# Altium schematic sheet Display_CPu.SchDoc: Display Card
size Tabloid; Date: 03/13/2023; Engineer: Terry D. Schevker; Address4: Display Card; Revision: 1.0; SheetNumber: 1; SheetTotal: 2
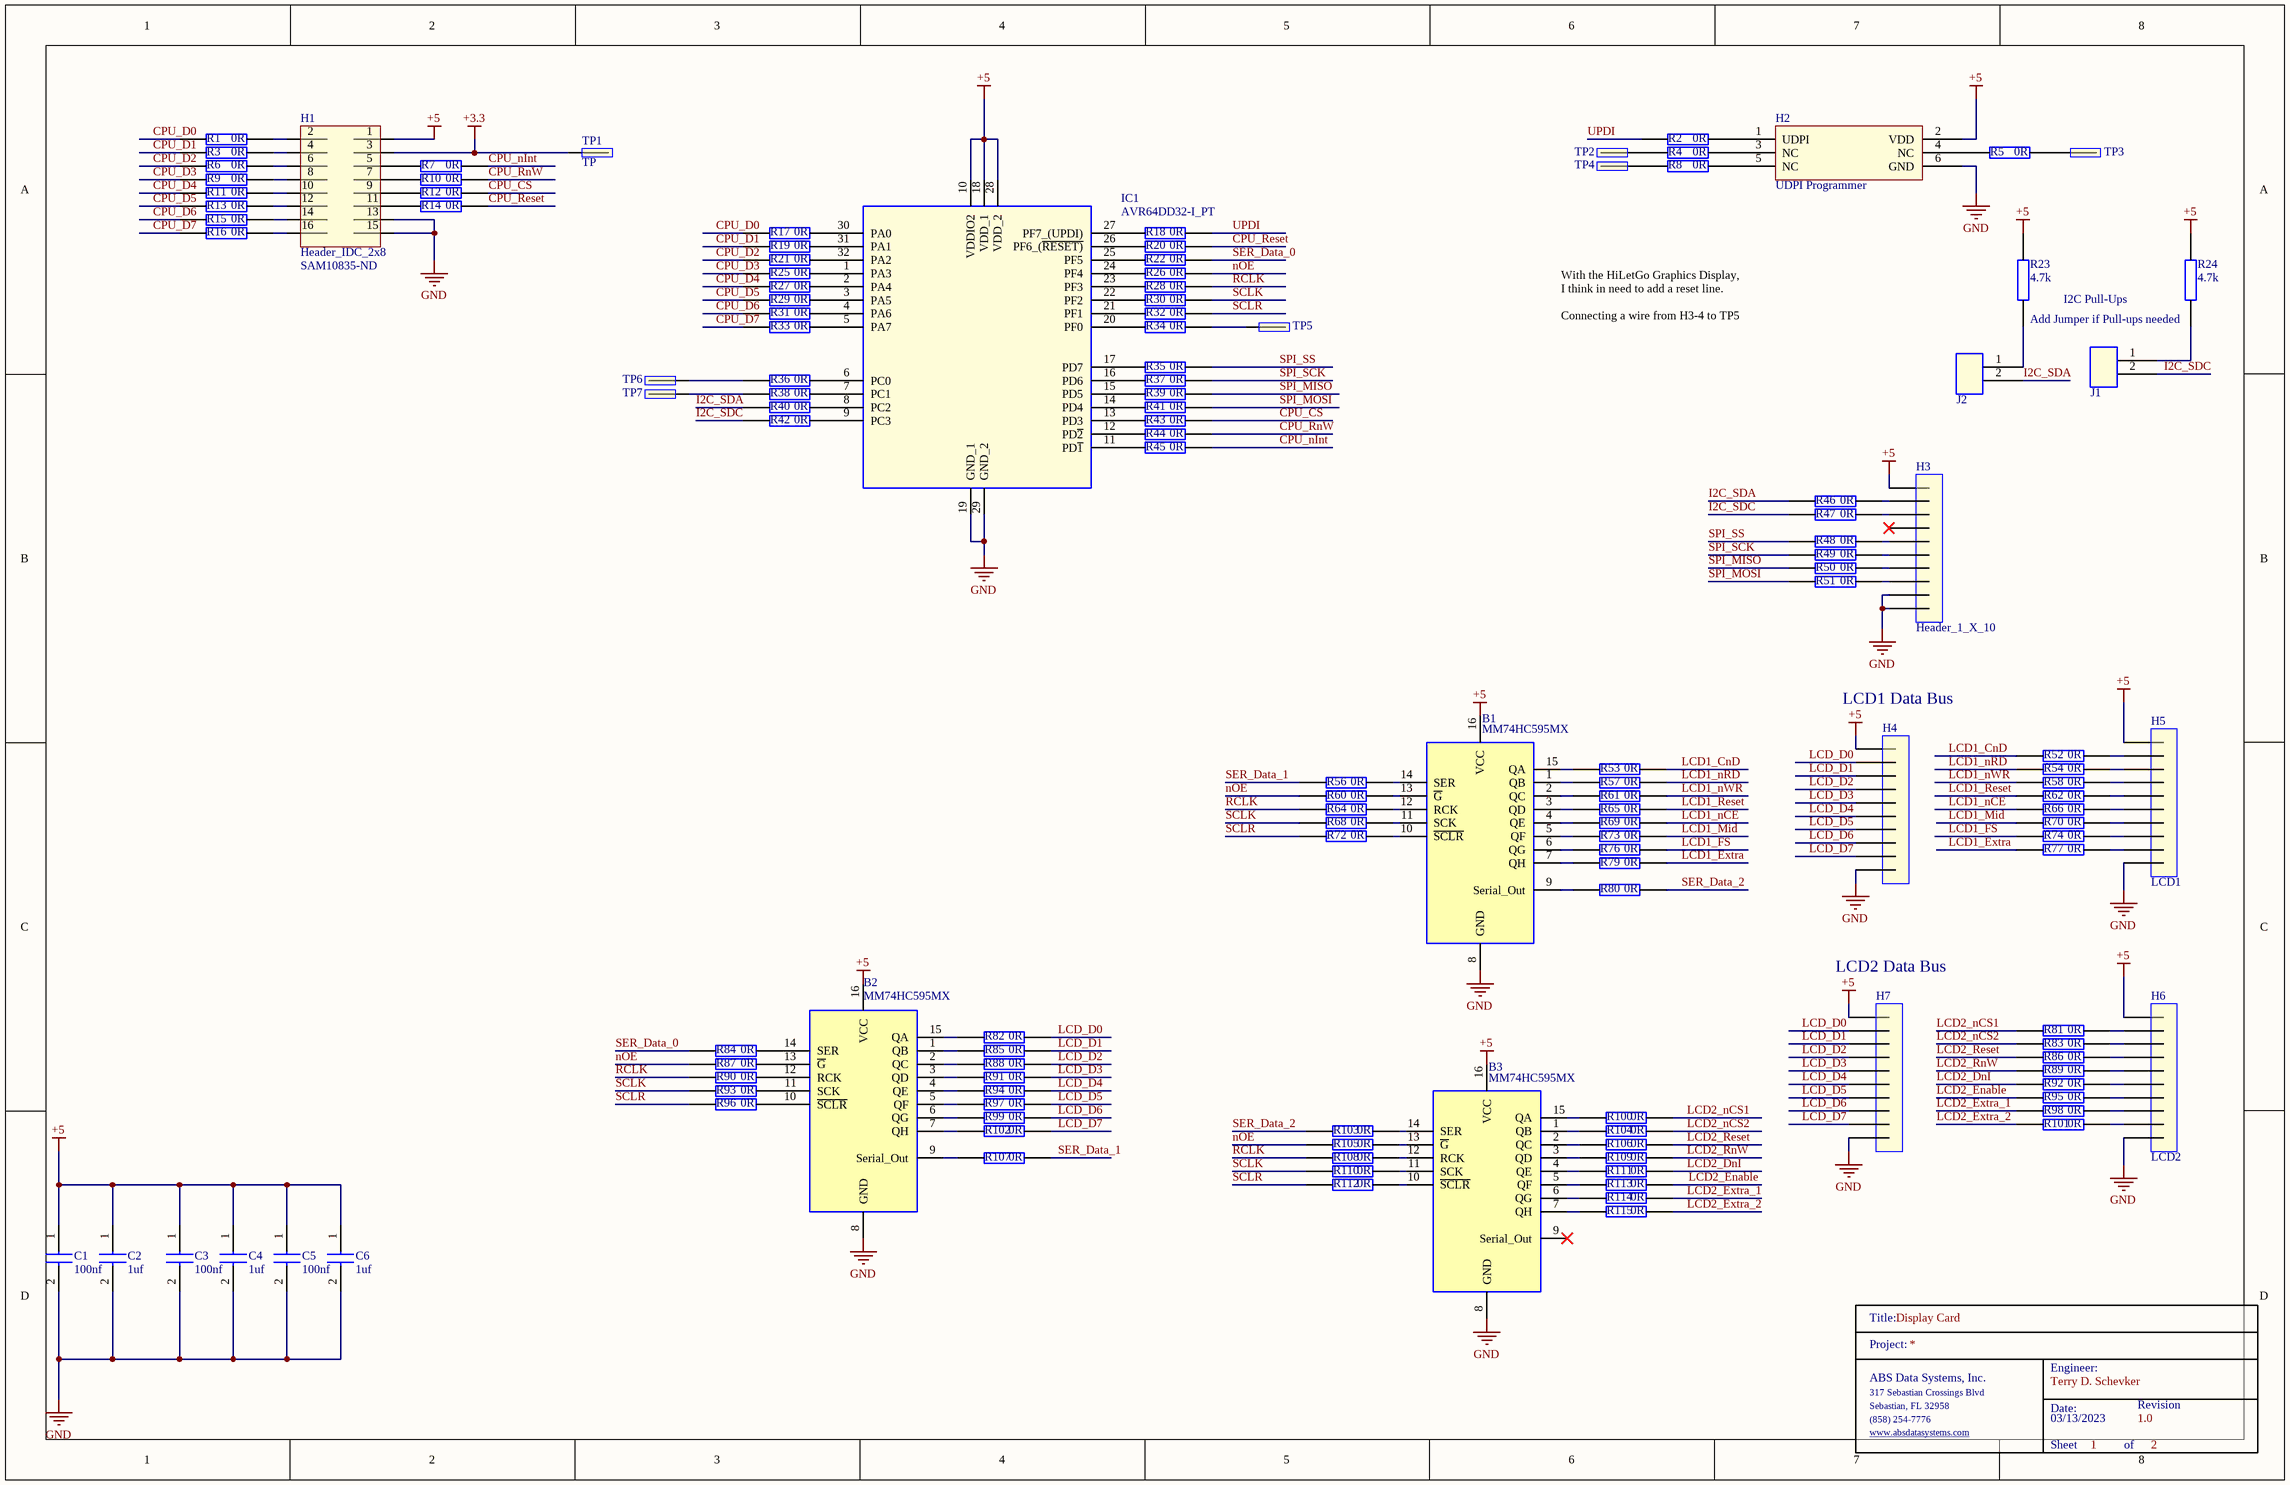
[diagram p0: Display_CPu.SchDoc]

## Parts
B1  MM74HC595MX  [SOIC127P600X175-16N]
B2  MM74HC595MX  [SOIC127P600X175-16N]
B3  MM74HC595MX  [SOIC127P600X175-16N]
C1  100nf  [0603]
C2  1uf  [0603]
C3  100nf  [0603]
C4  1uf  [0603]
C5  100nf  [0603]
C6  1uf  [0603]
H1  Header_IDC_2x8  Supplier Part Number 1: SAM10835-ND  [HEADER16]
H2  UDPI Programmer  [HDR2X3]
H3  Header_1_X_10  [TP_1X10]
H4  Header_1_X_10  [TP_1X10]  (value not drawn)
H5  LCD1  [TP_1X10]
H6  LCD2  [TP_1X10]
H7  Header_1_X_10  [TP_1X10]  (value not drawn)
IC1  AVR64DD32-I_PT  [QFP80P900X900X120-32N]
J1  Jumper  [Jumper]  (value not drawn)
J2  Jumper  [Jumper]  (value not drawn)
R1  0R  [0603]
R2  0R  [0603]
R3  0R  [0603]
R4  0R  [0603]
R5  0R  [0603]
R6  0R  [0603]
R7  0R  [0603]
R8  0R  [0603]
R9  0R  [0603]
R10  0R  [0603]
R11  0R  [0603]
R12  0R  [0603]
R13  0R  [0603]
R14  0R  [0603]
R15  0R  [0603]
R16  0R  [0603]
R17  0R  [0603]
R18  0R  [0603]
R19  0R  [0603]
R20  0R  [0603]
R21  0R  [0603]
R22  0R  [0603]
R23  4.7k  [0603]
R24  4.7k  [0603]
R25  0R  [0603]
R26  0R  [0603]
R27  0R  [0603]
R28  0R  [0603]
R29  0R  [0603]
R30  0R  [0603]
R31  0R  [0603]
R32  0R  [0603]
R33  0R  [0603]
R34  0R  [0603]
R35  0R  [0603]
R36  0R  [0603]
R37  0R  [0603]
R38  0R  [0603]
R39  0R  [0603]
R40  0R  [0603]
R41  0R  [0603]
R42  0R  [0603]
R43  0R  [0603]
R44  0R  [0603]
R45  0R  [0603]
R46  0R  [0603]
R47  0R  [0603]
R48  0R  [0603]
R49  0R  [0603]
R50  0R  [0603]
R51  0R  [0603]
R52  0R  [0603]
R53  0R  [0603]
R54  0R  [0603]
R56  0R  [0603]
R57  0R  [0603]
R58  0R  [0603]
R60  0R  [0603]
R61  0R  [0603]
R62  0R  [0603]
R64  0R  [0603]
R65  0R  [0603]
R66  0R  [0603]
R68  0R  [0603]
R69  0R  [0603]
R70  0R  [0603]
R72  0R  [0603]
R73  0R  [0603]
R74  0R  [0603]
R76  0R  [0603]
R77  0R  [0603]
R79  0R  [0603]
R80  0R  [0603]
R81  0R  [0603]
R82  0R  [0603]
R83  0R  [0603]
R84  0R  [0603]
R85  0R  [0603]
R86  0R  [0603]
R87  0R  [0603]
R88  0R  [0603]
R89  0R  [0603]
R90  0R  [0603]
R91  0R  [0603]
R92  0R  [0603]
R93  0R  [0603]
R94  0R  [0603]
R95  0R  [0603]
R96  0R  [0603]
R97  0R  [0603]
R98  0R  [0603]
R99  0R  [0603]
R100  0R  [0603]
R101  0R  [0603]
R102  0R  [0603]
R103  0R  [0603]
R104  0R  [0603]
R105  0R  [0603]
R106  0R  [0603]
R107  0R  [0603]
R108  0R  [0603]
R109  0R  [0603]
R110  0R  [0603]
R111  0R  [0603]
R112  0R  [0603]
R113  0R  [0603]
R114  0R  [0603]
R115  0R  [0603]
TitleBlock_1  TitleBlock  (value not drawn)  (graphical)
TP1  TP  [TP]
TP2  TP  [TP]  (value not drawn)
TP3  TP  [TP]  (value not drawn)
TP4  TP  [TP]  (value not drawn)
TP5  TP  [TP]  (value not drawn)
TP6  TP  [TP]  (value not drawn)
TP7  TP  [TP]  (value not drawn)

## Nets
+3.3: H1.3 TP1.1
+5: B1.16(VCC) B2.16(VCC) B3.16(VCC) C1.1 C2.1 C3.1 C4.1 C5.1 C6.1 H1.1 H2.2(VDD) H3.1 H4.1 H5.1 H6.1 H7.1 IC1.10(VDDIO2) IC1.18(VDD_1) IC1.28(VDD_2) R23.2 R24.2
GND: B1.8(GND) B2.8(GND) B3.8(GND) C1.2 C2.2 C3.2 C4.2 C5.2 C6.2 H1.13 H1.15 H2.6(GND) H3.9 H3.10 H4.10 H5.10 H6.10 H7.10 IC1.19(GND_1) IC1.29(GND_2)
CPU_CS: R12.2 R43.2
CPU_D0: R1.1 R17.1
CPU_D1: R3.1 R19.1
CPU_D2: R6.1 R21.1
CPU_D3: R9.1 R25.1
CPU_D4: R11.1 R27.1
CPU_D5: R13.1 R29.1
CPU_D6: R15.1 R31.1
CPU_D7: R16.1 R33.1
CPU_nInt: R7.2 R45.2
CPU_Reset: R14.2 R20.2
CPU_RnW: R10.2 R44.2
I2C_SDA: J2.2 R40.1 R46.1
I2C_SDC: J1.2 R42.1 R47.1
LCD1_CnD: R52.1 R53.2
LCD1_Extra: R77.1 R79.2
LCD1_FS: R74.1 R76.2
LCD1_Mid: R70.1 R73.2
LCD1_nCE: R66.1 R69.2
LCD1_nRD: R54.1 R57.2
LCD1_nWR: R58.1 R61.2
LCD1_Reset: R62.1 R65.2
LCD2_DnI: R92.1 R111.2
LCD2_Enable: R95.1 R113.2
LCD2_Extra_1: R98.1 R114.2
LCD2_Extra_2: R101.1 R115.2
LCD2_nCS1: R81.1 R100.2
LCD2_nCS2: R83.1 R104.2
LCD2_Reset: R86.1 R106.2
LCD2_RnW: R89.1 R109.2
LCD_D0: H4.2 H7.2 R82.2
LCD_D1: H4.3 H7.3 R85.2
LCD_D2: H4.4 H7.4 R88.2
LCD_D3: H4.5 H7.5 R91.2
LCD_D4: H4.6 H7.6 R94.2
LCD_D5: H4.7 H7.7 R97.2
LCD_D6: H4.8 H7.8 R99.2
LCD_D7: H4.9 H7.9 R102.2
nOE: R26.2 R60.1 R87.1 R105.1
RCLK: R28.2 R64.1 R90.1 R108.1
SCLK: R30.2 R68.1 R93.1 R110.1
SCLR: R32.2 R72.1 R96.1 R112.1
SER_Data_0: R22.2 R84.1
SER_Data_1: R56.1 R107.2
SER_Data_2: R80.2 R103.1
SPI_MISO: R39.2 R50.1
SPI_MOSI: R41.2 R51.1
SPI_SCK: R37.2 R49.1
SPI_SS: R35.2 R48.1
UPDI: R2.1 R18.2
NetB1_1: B1.1(QB) R57.1
NetB1_2: B1.2(QC) R61.1
NetB1_3: B1.3(QD) R65.1
NetB1_4: B1.4(QE) R69.1
NetB1_5: B1.5(QF) R73.1
NetB1_6: B1.6(QG) R76.1
NetB1_7: B1.7(QH) R79.1
NetB1_9: B1.9(Serial_Out) R80.1
NetB1_10: B1.10(~{SCLR}) R72.2
NetB1_11: B1.11(SCK) R68.2
NetB1_12: B1.12(RCK) R64.2
NetB1_13: B1.13(~{G}) R60.2
NetB1_14: B1.14(SER) R56.2
NetB1_15: B1.15(QA) R53.1
NetB2_1: B2.1(QB) R85.1
NetB2_2: B2.2(QC) R88.1
NetB2_3: B2.3(QD) R91.1
NetB2_4: B2.4(QE) R94.1
NetB2_5: B2.5(QF) R97.1
NetB2_6: B2.6(QG) R99.1
NetB2_7: B2.7(QH) R102.1
NetB2_9: B2.9(Serial_Out) R107.1
NetB2_10: B2.10(~{SCLR}) R96.2
NetB2_11: B2.11(SCK) R93.2
NetB2_12: B2.12(RCK) R90.2
NetB2_13: B2.13(~{G}) R87.2
NetB2_14: B2.14(SER) R84.2
NetB2_15: B2.15(QA) R82.1
NetB3_1: B3.1(QB) R104.1
NetB3_2: B3.2(QC) R106.1
NetB3_3: B3.3(QD) R109.1
NetB3_4: B3.4(QE) R111.1
NetB3_5: B3.5(QF) R113.1
NetB3_6: B3.6(QG) R114.1
NetB3_7: B3.7(QH) R115.1
NetB3_10: B3.10(~{SCLR}) R112.2
NetB3_11: B3.11(SCK) R110.2
NetB3_12: B3.12(RCK) R108.2
NetB3_13: B3.13(~{G}) R105.2
NetB3_14: B3.14(SER) R103.2
NetB3_15: B3.15(QA) R100.1
NetH1_2: H1.2 R1.2
NetH1_4: H1.4 R3.2
NetH1_5: H1.5 R7.1
NetH1_6: H1.6 R6.2
NetH1_7: H1.7 R10.1
NetH1_8: H1.8 R9.2
NetH1_9: H1.9 R12.1
NetH1_10: H1.10 R11.2
NetH1_11: H1.11 R14.1
NetH1_12: H1.12 R13.2
NetH1_14: H1.14 R15.2
NetH1_16: H1.16 R16.2
NetH2_1: H2.1(UDPI) R2.2
NetH2_3: H2.3(NC) R4.2
NetH2_4: H2.4(NC) R5.1
NetH2_5: H2.5(NC) R8.2
NetH3_2: H3.2 R46.2
NetH3_3: H3.3 R47.2
NetH3_5: H3.5 R48.2
NetH3_6: H3.6 R49.2
NetH3_7: H3.7 R50.2
NetH3_8: H3.8 R51.2
NetH5_2: H5.2 R52.2
NetH5_3: H5.3 R54.2
NetH5_4: H5.4 R58.2
NetH5_5: H5.5 R62.2
NetH5_6: H5.6 R66.2
NetH5_7: H5.7 R70.2
NetH5_8: H5.8 R74.2
NetH5_9: H5.9 R77.2
NetH6_2: H6.2 R81.2
NetH6_3: H6.3 R83.2
NetH6_4: H6.4 R86.2
NetH6_5: H6.5 R89.2
NetH6_6: H6.6 R92.2
NetH6_7: H6.7 R95.2
NetH6_8: H6.8 R98.2
NetH6_9: H6.9 R101.2
NetIC1_1: IC1.1(PA3) R25.2
NetIC1_2: IC1.2(PA4) R27.2
NetIC1_3: IC1.3(PA5) R29.2
NetIC1_4: IC1.4(PA6) R31.2
NetIC1_5: IC1.5(PA7) R33.2
NetIC1_6: IC1.6(PC0) R36.2
NetIC1_7: IC1.7(PC1) R38.2
NetIC1_8: IC1.8(PC2) R40.2
NetIC1_9: IC1.9(PC3) R42.2
NetIC1_11: IC1.11(PD~{1}) R45.1
NetIC1_12: IC1.12(PD~{2}) R44.1
NetIC1_13: IC1.13(PD3) R43.1
NetIC1_14: IC1.14(PD4) R41.1
NetIC1_15: IC1.15(PD5) R39.1
NetIC1_16: IC1.16(PD6) R37.1
NetIC1_17: IC1.17(PD7) R35.1
NetIC1_20: IC1.20(PF0) R34.1
NetIC1_21: IC1.21(PF1) R32.1
NetIC1_22: IC1.22(PF2) R30.1
NetIC1_23: IC1.23(PF3) R28.1
NetIC1_24: IC1.24(PF4) R26.1
NetIC1_25: IC1.25(PF5) R22.1
NetIC1_26: IC1.26(PF6_(~{RESET)}) R20.1
NetIC1_27: IC1.27(PF7_(UPDI)) R18.1
NetIC1_30: IC1.30(PA0) R17.2
NetIC1_31: IC1.31(PA1) R19.2
NetIC1_32: IC1.32(PA2) R21.2
NetJ1_1: J1.1 R24.1
NetJ2_1: J2.1 R23.1
NetR4_1: R4.1 TP2.1
NetR5_2: R5.2 TP3.1
NetR8_1: R8.1 TP4.1
NetR34_2: R34.2 TP5.1
NetR36_1: R36.1 TP6.1
NetR38_1: R38.1 TP7.1

Not connected (* = marked no-connect by the designer): B3 9(Serial_Out)*; H3 4*

## Notes on the sheet
- I2C Pull-Ups
- Add Jumper if Pull-ups needed
- With the HiLetGo Graphics Display, I think in need to add a reset line.
  Connecting a wire from H3-4 to TP5
- (near H4) LCD1 Data Bus
- (near H7) LCD2 Data Bus
- (in symbol TitleBlock) Title:; Project:; Engineer:; ABS Data Systems, Inc.; 317 Sebastian Crossings Blvd; Sebastian, FL 32958; Date:; Revision; (858) 254-7776; www.absdatasystems.com; Sheet; of

## Library data of the parts
B1-B3 = MM74HC595MX: Shift Register HS 8 Bit CMOS SOIC16; Manufacturer_Name: onsemi; Geometry.Height: 1.75mm; Mouser Part Number: 512-MM74HC595MX; Mouser Price/Stock: https://www.mouser.co.uk/ProductDetail/onsemi-Fairchild/MM74HC595MX?qs=Qb0BA3xILelPReDH8l7J4w%3D%3D; Manufacturer_Part_Number: MM74HC595MX; Datasheet Link: *
C1 C3 C5 = CL10B104JB8NNNC: Samsung Electro-Mechanics 0603 100nf
C2 C4 C6 = CL10B105KA8NNNL: Samsung Electro-Mechanics 0603 1uf
H1 = Header_IDC_2x8: 16 Pin 2x8 Through Hold IDC Connector; Manufacturer: Samtec; Manufacturer Part Number: TST-108-01-G-D; Number of Contacts: 16; Gender: Male; Connector Type: Male Pin; Pitch: 2.54mm; Row Spacing: 0.1inch; Supplier 1: Digi-Key; RoHS: Yes; Category: Headers and Wire Housings; Stock 1: 227; Pricing 1: 1=2.85000, 10=2.73600, 100=2.28000, 500=1.93800, 1000=1.65300, 5000=1.48200 (USD); Mount: Through Hole; Contact Plating: Gold; Contact Material: Bronze; Housing Material: Polyester; Housing Color: Black; Color: Black; Min Operating Temperature: -55°C; Max Operating Temperature: 125°C; Number of Rows: 2; Termination: Solder; Packaging: Rail/Tube; Orientation: Straight; Number of Positions: 16; Length: 27.94mm; Depth: 9.27mm; Contact Mating Length: 0.25inch; REACH SVHC: No SVHC; ComponentLink1URL: https://datasheet.ciiva.com/739/tst-mkt-739845.pdf?src-supplier=Digi-Key; ComponentLink1Description: https://datasheet.ciiva.com/739/tst-mkt-739845.pdf?src-supplier=Digi-Key; ComponentLink2URL: https://datasheet.ciiva.com/10018/htst-10018510.pdf?src-supplier=Avnet; ComponentLink2Description: https://datasheet.ciiva.com/10018/htst-10018510.pdf?src-supplier=Avnet
H2 = UDPI Programmer: 6 Pin 2X3 Through Hole Header
H3-H7 = Header_1_X_10: Manufacturer: Samtec; Manufacturer Part Number: TST-105-01-G-D; Number of Contacts: 16; Gender: Male; Connector Type: Male Pin; Pitch: 2.54mm; Row Spacing: 0.1inch; Supplier 1: Digi-Key; RoHS: Yes; Category: Headers and Wire Housings; Stock 1: 227; Pricing 1: 1=2.85000, 10=2.73600, 100=2.28000, 500=1.93800, 1000=1.65300, 5000=1.48200 (USD); Mount: Through Hole; Contact Plating: Gold; Contact Material: Bronze; Housing Material: Polyester; Housing Color: Black; Color: Black; Min Operating Temperature: -55°C; Max Operating Temperature: 125°C; Number of Rows: 2; Termination: Solder; Packaging: Rail/Tube; Orientation: Straight; Number of Positions: 16; Length: 27.94mm; Depth: 9.27mm; Contact Mating Length: 0.25inch; REACH SVHC: No SVHC; ComponentLink1URL: https://datasheet.ciiva.com/739/tst-mkt-739845.pdf?src-supplier=Digi-Key; ComponentLink1Description: https://datasheet.ciiva.com/739/tst-mkt-739845.pdf?src-supplier=Digi-Key; ComponentLink2URL: https://datasheet.ciiva.com/10018/htst-10018510.pdf?src-supplier=Avnet; ComponentLink2Description: https://datasheet.ciiva.com/10018/htst-10018510.pdf?src-supplier=Avnet
IC1 = AVR64DD32-I_PT: Integrated Circuit; Manufacturer_Name: Microchip; Manufacturer_Part_Number: AVR64DD32-I/PT | MULTI-VOLTAGE I/O; Datasheet Link: https://www.microchip.com/en-us/product/AVR64DD32; Height: 1.2mm
J1 J2 = Jumper: 16 Pin 3x8 Through Hold Jumprts; Manufacturer: Samtec; Manufacturer Part Number: TST-108-01-G-D; Number of Contacts: 16; Gender: Male; Connector Type: Male Pin; Pitch: 2.54mm; Row Spacing: 0.1inch; Supplier 1: Digi-Key; RoHS: Yes; Category: Headers and Wire Housings; Stock 1: 227; Pricing 1: 1=2.85000, 10=2.73600, 100=2.28000, 500=1.93800, 1000=1.65300, 5000=1.48200 (USD); Mount: Through Hole; Contact Plating: Gold; Contact Material: Bronze; Housing Material: Polyester; Housing Color: Black; Color: Black; Min Operating Temperature: -55°C; Max Operating Temperature: 125°C; Number of Rows: 2; Termination: Solder; Packaging: Rail/Tube; Orientation: Straight; Number of Positions: 16; Length: 27.94mm; Depth: 9.27mm; Contact Mating Length: 0.25inch; REACH SVHC: No SVHC; ComponentLink1URL: https://datasheet.ciiva.com/739/tst-mkt-739845.pdf?src-supplier=Digi-Key; ComponentLink1Description: https://datasheet.ciiva.com/739/tst-mkt-739845.pdf?src-supplier=Digi-Key; ComponentLink2URL: https://datasheet.ciiva.com/10018/htst-10018510.pdf?src-supplier=Avnet; ComponentLink2Description: https://datasheet.ciiva.com/10018/htst-10018510.pdf?src-supplier=Avnet
R1-R22 R25-R54 R56-R58 R60-R62 R64-R66 R68-R70 R72-R74 R76 R77 R79-R115 = RC0603JR-070RL: YAGEO 0603 0 ohm; Manufacturer_Name: KEMET; Geometry.Height: 0.55mm; Mouser Part Number: 603-RC0603JR-070RL; Mouser Price/Stock: https://www.mouser.co.uk/ProductDetail/YAGEO/RC0603JR-070RL?qs=2cAdsCoAWRGWyPcuXgGiXQ%3D%3D; Manufacturer_Part_Number: RC0603JR-070RL; Datasheet Link: https://datasheet.datasheetarchive.com/originals/distributors/Datasheets_SAMA/902f9e387b938f871d31120f5fc1d65e.pdf
R23 R24 = RC0603FR-104K7L: YAGEO 0603 4.7k; Manufacturer_Name: KEMET; Manufacturer_Part_Number: RC0603JR-070RL; Geometry.Height: 0.55mm; Mouser Part Number: 603-RC0603JR-070RL; Mouser Price/Stock: https://www.mouser.co.uk/ProductDetail/YAGEO/RC0603JR-070RL?qs=2cAdsCoAWRGWyPcuXgGiXQ%3D%3D; Datasheet Link: https://datasheet.datasheetarchive.com/originals/distributors/Datasheets_SAMA/902f9e387b938f871d31120f5fc1d65e.pdf
TP1-TP7 = TP: Manufacturer: Samtec; Manufacturer Part Number: TST-105-01-G-D; Number of Contacts: 16; Gender: Male; Connector Type: Male Pin; Pitch: 2.54mm; Row Spacing: 0.1inch; Supplier 1: Digi-Key; RoHS: Yes; Category: Headers and Wire Housings; Stock 1: 227; Pricing 1: 1=2.85000, 10=2.73600, 100=2.28000, 500=1.93800, 1000=1.65300, 5000=1.48200 (USD); Mount: Through Hole; Contact Plating: Gold; Contact Material: Bronze; Housing Material: Polyester; Housing Color: Black; Color: Black; Min Operating Temperature: -55°C; Max Operating Temperature: 125°C; Number of Rows: 2; Termination: Solder; Packaging: Rail/Tube; Orientation: Straight; Number of Positions: 16; Length: 27.94mm; Depth: 9.27mm; Contact Mating Length: 0.25inch; REACH SVHC: No SVHC; ComponentLink1URL: https://datasheet.ciiva.com/739/tst-mkt-739845.pdf?src-supplier=Digi-Key; ComponentLink1Description: https://datasheet.ciiva.com/739/tst-mkt-739845.pdf?src-supplier=Digi-Key; ComponentLink2URL: https://datasheet.ciiva.com/10018/htst-10018510.pdf?src-supplier=Avnet; ComponentLink2Description: https://datasheet.ciiva.com/10018/htst-10018510.pdf?src-supplier=Avnet